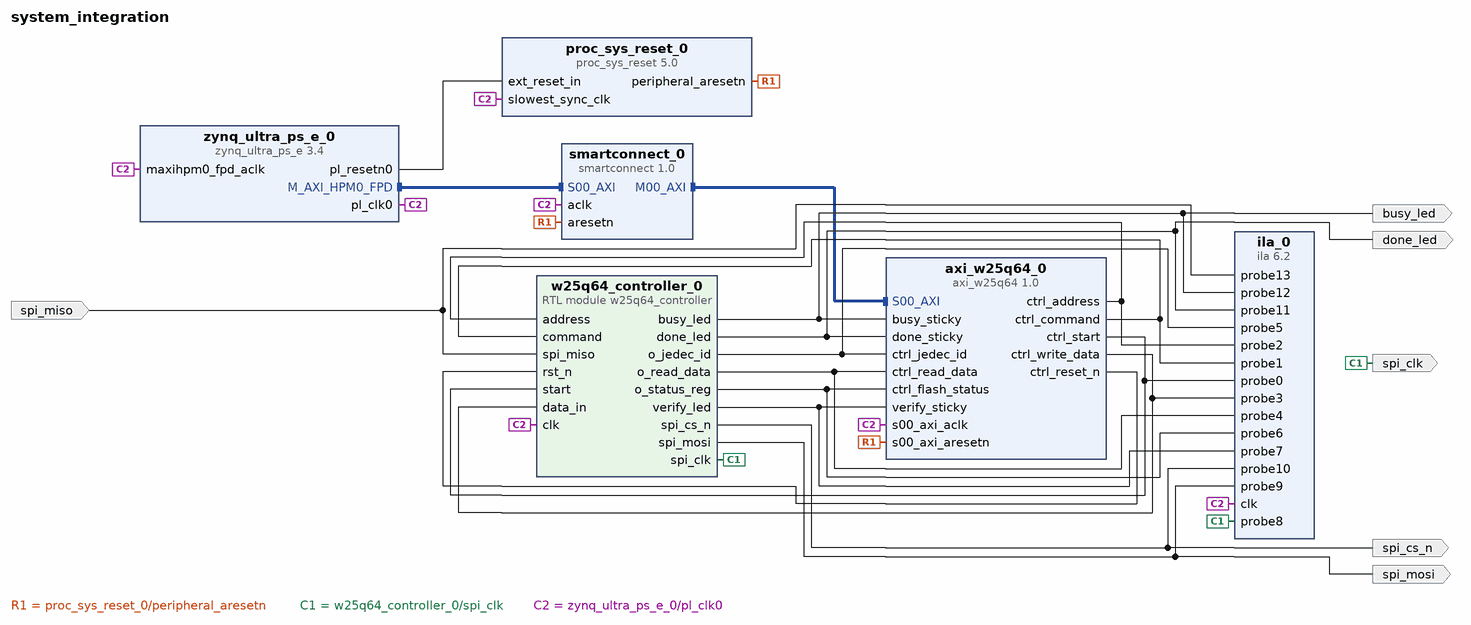
[diagram p0: block diagram of the top level]
# Vivado block design system_integration, xck26-sfvc784-2LV-c, Vivado 2022.2
create_bd_design system_integration

create_bd_port -dir O spi_clk
create_bd_port -dir O spi_mosi
create_bd_port -dir O spi_cs_n
create_bd_port -dir I spi_miso
create_bd_port -dir O done_led
create_bd_port -dir O busy_led

create_bd_cell -type ip -vlnv xilinx.com:ip:zynq_ultra_ps_e:3.4 zynq_ultra_ps_e_0
set_property -dict [list \
  CONFIG.PSU__DDR_HIGH_ADDRESS_GUI_ENABLE 0 \
  CONFIG.PSU__MAXIGP0__DATA_WIDTH 128 \
  CONFIG.PSU__USE__M_AXI_GP0 1 \
  CONFIG.PSU__USE__M_AXI_GP2 0 \
] [get_bd_cells zynq_ultra_ps_e_0]
# 2 more settings of zynq_ultra_ps_e_0 are not shown: defaults, MIO pin electricals, DDR timing, and values the tool derives
create_bd_cell -type ip -vlnv xilinx.com:ip:proc_sys_reset:5.0 proc_sys_reset_0
create_bd_cell -type ip -vlnv xilinx.com:ip:smartconnect:1.0 smartconnect_0
create_bd_cell -type ip -vlnv xilinx.com:user:axi_w25q64:1.0 axi_w25q64_0
create_bd_cell -type ip -vlnv xilinx.com:ip:ila:6.2 ila_0
set_property -dict [list \
  CONFIG.C_MONITOR_TYPE Native \
  CONFIG.C_NUM_OF_PROBES 14 \
  CONFIG.C_PROBE1_WIDTH 3 \
  CONFIG.C_PROBE2_WIDTH 24 \
  CONFIG.C_PROBE3_WIDTH 16 \
  CONFIG.C_PROBE4_WIDTH 16 \
  CONFIG.C_PROBE5_WIDTH 24 \
  CONFIG.C_PROBE6_WIDTH 8 \
] [get_bd_cells ila_0]
create_bd_cell -type module -reference w25q64_controller w25q64_controller_0

# ---- connections ----

connect_bd_intf_net [get_bd_intf_pins axi_w25q64_0/S00_AXI] [get_bd_intf_pins smartconnect_0/M00_AXI]
connect_bd_intf_net [get_bd_intf_pins smartconnect_0/S00_AXI] [get_bd_intf_pins zynq_ultra_ps_e_0/M_AXI_HPM0_FPD]
connect_bd_net [get_bd_pins axi_w25q64_0/ctrl_address] [get_bd_pins ila_0/probe2] [get_bd_pins w25q64_controller_0/address]
connect_bd_net [get_bd_pins axi_w25q64_0/ctrl_command] [get_bd_pins ila_0/probe1] [get_bd_pins w25q64_controller_0/command]
connect_bd_net [get_bd_pins axi_w25q64_0/ctrl_reset_n] [get_bd_pins w25q64_controller_0/rst_n]
connect_bd_net [get_bd_pins axi_w25q64_0/ctrl_start] [get_bd_pins ila_0/probe0] [get_bd_pins w25q64_controller_0/start]
connect_bd_net [get_bd_pins axi_w25q64_0/ctrl_write_data] [get_bd_pins ila_0/probe3] [get_bd_pins w25q64_controller_0/data_in]
connect_bd_net [get_bd_pins proc_sys_reset_0/peripheral_aresetn] [get_bd_pins smartconnect_0/aresetn] [get_bd_pins axi_w25q64_0/s00_axi_aresetn]
connect_bd_net [get_bd_ports spi_miso] [get_bd_pins ila_0/probe13] [get_bd_pins w25q64_controller_0/spi_miso]
connect_bd_net [get_bd_pins w25q64_controller_0/busy_led] [get_bd_ports busy_led] [get_bd_pins axi_w25q64_0/busy_sticky] [get_bd_pins ila_0/probe12]
connect_bd_net [get_bd_pins w25q64_controller_0/done_led] [get_bd_ports done_led] [get_bd_pins axi_w25q64_0/done_sticky] [get_bd_pins ila_0/probe11]
connect_bd_net [get_bd_pins w25q64_controller_0/o_jedec_id] [get_bd_pins axi_w25q64_0/ctrl_jedec_id] [get_bd_pins ila_0/probe5]
connect_bd_net [get_bd_pins w25q64_controller_0/o_read_data] [get_bd_pins axi_w25q64_0/ctrl_read_data] [get_bd_pins ila_0/probe4]
connect_bd_net [get_bd_pins w25q64_controller_0/o_status_reg] [get_bd_pins axi_w25q64_0/ctrl_flash_status] [get_bd_pins ila_0/probe6]
connect_bd_net [get_bd_pins w25q64_controller_0/spi_clk] [get_bd_ports spi_clk] [get_bd_pins ila_0/probe8]
connect_bd_net [get_bd_pins w25q64_controller_0/spi_cs_n] [get_bd_ports spi_cs_n] [get_bd_pins ila_0/probe10]
connect_bd_net [get_bd_pins w25q64_controller_0/spi_mosi] [get_bd_ports spi_mosi] [get_bd_pins ila_0/probe9]
connect_bd_net [get_bd_pins w25q64_controller_0/verify_led] [get_bd_pins axi_w25q64_0/verify_sticky] [get_bd_pins ila_0/probe7]
connect_bd_net [get_bd_pins zynq_ultra_ps_e_0/pl_clk0] \
  [get_bd_pins zynq_ultra_ps_e_0/maxihpm0_fpd_aclk] [get_bd_pins proc_sys_reset_0/slowest_sync_clk] \
  [get_bd_pins smartconnect_0/aclk] [get_bd_pins axi_w25q64_0/s00_axi_aclk] [get_bd_pins ila_0/clk] \
  [get_bd_pins w25q64_controller_0/clk]
connect_bd_net [get_bd_pins zynq_ultra_ps_e_0/pl_resetn0] [get_bd_pins proc_sys_reset_0/ext_reset_in]

# ---- address map ----
assign_bd_address -offset 0x00A0000000 -range 64K -target_address_space [get_bd_addr_spaces zynq_ultra_ps_e_0/Data] [get_bd_addr_segs axi_w25q64_0/S00_AXI/S00_AXI_reg]

validate_bd_design
save_bd_design
